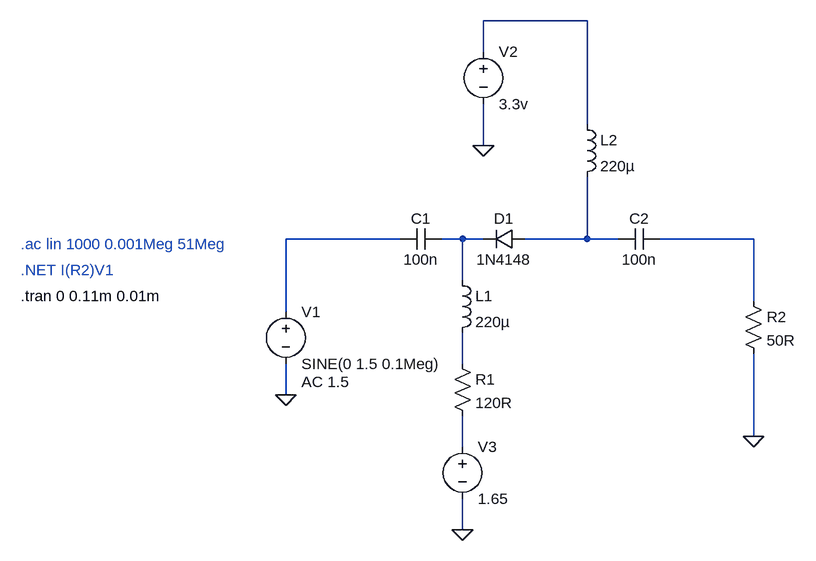
[diagram p0: schematic 80m_filter.asc]
80m_filter.asc, the LTspice schematic file:
Version 4
SHEET 1 1352 680
WIRE 528 -352 368 -352
WIRE 368 -304 368 -352
WIRE 528 -192 528 -352
WIRE 368 -160 368 -224
WIRE 240 -16 64 -16
WIRE 336 -16 304 -16
WIRE 368 -16 336 -16
WIRE 528 -16 528 -112
WIRE 528 -16 432 -16
WIRE 576 -16 528 -16
WIRE 784 -16 640 -16
WIRE 336 48 336 -16
WIRE 784 80 784 -16
WIRE 64 96 64 -16
WIRE 336 176 336 128
WIRE 64 224 64 176
WIRE 784 288 784 160
WIRE 336 304 336 256
WIRE 336 432 336 384
FLAG 64 224 0
FLAG 784 288 0
FLAG 368 -160 0
FLAG 336 432 0
SYMBOL voltage 64 80 R0
WINDOW 123 24 124 Left 2
WINDOW 39 0 0 Left 0
SYMATTR Value2 AC 1.5
SYMATTR InstName V1
SYMATTR Value SINE(0 1.5 0.1Meg)
SYMBOL cap 304 -32 R90
WINDOW 0 0 32 VBottom 2
WINDOW 3 32 32 VTop 2
SYMATTR InstName C1
SYMATTR Value 100n
SYMBOL ind 320 32 R0
SYMATTR InstName L1
SYMATTR Value 220µ
SYMBOL res 320 160 R0
SYMATTR InstName R1
SYMATTR Value 120R
SYMBOL cap 640 -32 R90
WINDOW 0 0 32 VBottom 2
WINDOW 3 32 32 VTop 2
SYMATTR InstName C2
SYMATTR Value 100n
SYMBOL res 768 64 R0
SYMATTR InstName R2
SYMATTR Value 50R
SYMBOL ind 512 -208 R0
SYMATTR InstName L2
SYMATTR Value 220µ
SYMBOL voltage 368 -320 R0
WINDOW 123 0 0 Left 0
WINDOW 39 0 0 Left 0
SYMATTR InstName V2
SYMATTR Value 3.3v
SYMBOL diode 432 -32 R90
WINDOW 0 0 32 VBottom 2
WINDOW 3 32 32 VTop 2
SYMATTR InstName D1
SYMATTR Value 1N4148
SYMBOL voltage 336 288 R0
WINDOW 123 0 0 Left 0
WINDOW 39 0 0 Left 0
SYMATTR InstName V3
SYMATTR Value 1.65
TEXT -344 -8 Left 2 ;.ac lin 1000 0.001Meg 51Meg
TEXT -344 32 Left 2 ;.NET I(R2)V1
TEXT -344 72 Left 2 !.tran 0 0.11m 0.01m

The netlist it stands for:
* 80m_filter.asc
V1 N002 0 SINE(0 1.5 0.1Meg) AC 1.5
C1 N003 N002 100n
L1 N003 N006 220µ
R1 N006 N007 120R
C2 N005 N004 100n
R2 N005 0 50R
L2 N001 N004 220µ
V2 N001 0 3.3v
D1 N004 N003 1N4148
V3 N007 0 1.65
.model D D
.lib standard.dio
* .ac lin 1000 0.001Meg 51Meg
* .NET I(R2)V1
.tran 0 0.11m 0.01m
.backanno
.end